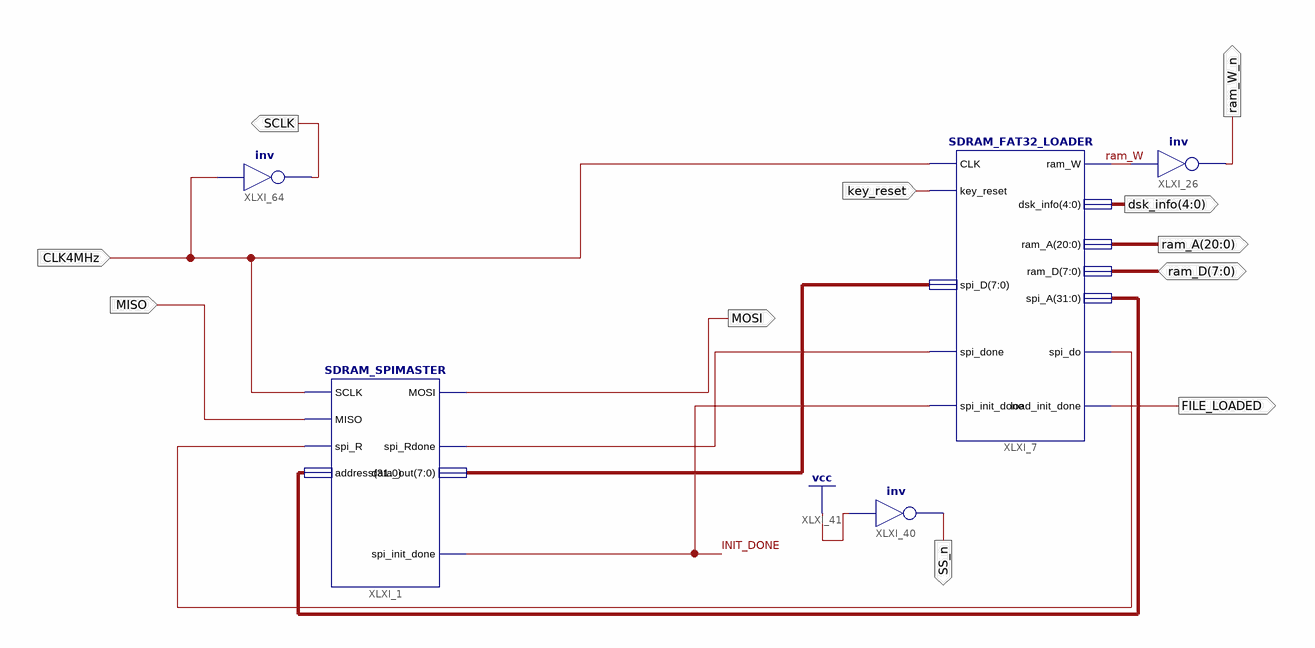
[diagram p0: schematic sheet 1]
// Xilinx ISE schematic bootloader_sd.sch (spartan6) as structural Verilog: 5 symbols, 11 ports
module bootloader_sd (
  input  MISO,
  input  CLK4MHz,
  input  key_reset,
  inout  [7:0] ram_D,
  output MOSI,
  output [20:0] ram_A,
  output SCLK,
  output ram_W_n,
  output SS_n,
  output FILE_LOADED,
  output [4:0] dsk_info
);

  wire INIT_DONE, ram_W, XLXN_57, XLXN_61;
  wire [7:0] XLXN_52;
  wire [31:0] XLXN_55;

  SDRAM_SPIMASTER XLXI_1 (
    .SCLK(CLK4MHz), .MISO(MISO), .spi_R(XLXN_61), .address(XLXN_55), .MOSI(MOSI), .spi_Rdone(XLXN_57),
    .spi_init_done(INIT_DONE), .data_out(XLXN_52));
  SDRAM_FAT32_LOADER XLXI_7 (
    .CLK(CLK4MHz), .spi_done(XLXN_57), .spi_init_done(INIT_DONE), .key_reset(key_reset), .spi_D(XLXN_52),
    .ram_D(ram_D), .ram_W(ram_W), .spi_do(XLXN_61), .load_init_done(FILE_LOADED), .ram_A(ram_A),
    .spi_A(XLXN_55), .dsk_info(dsk_info));
  not XLXI_26 (ram_W_n, ram_W);
  not XLXI_40 (SS_n, 1'b1);
  not XLXI_64 (SCLK, CLK4MHz);
endmodule
